# EAGLE design Single Sided Smoothie v2 (EAGLE 6.4)
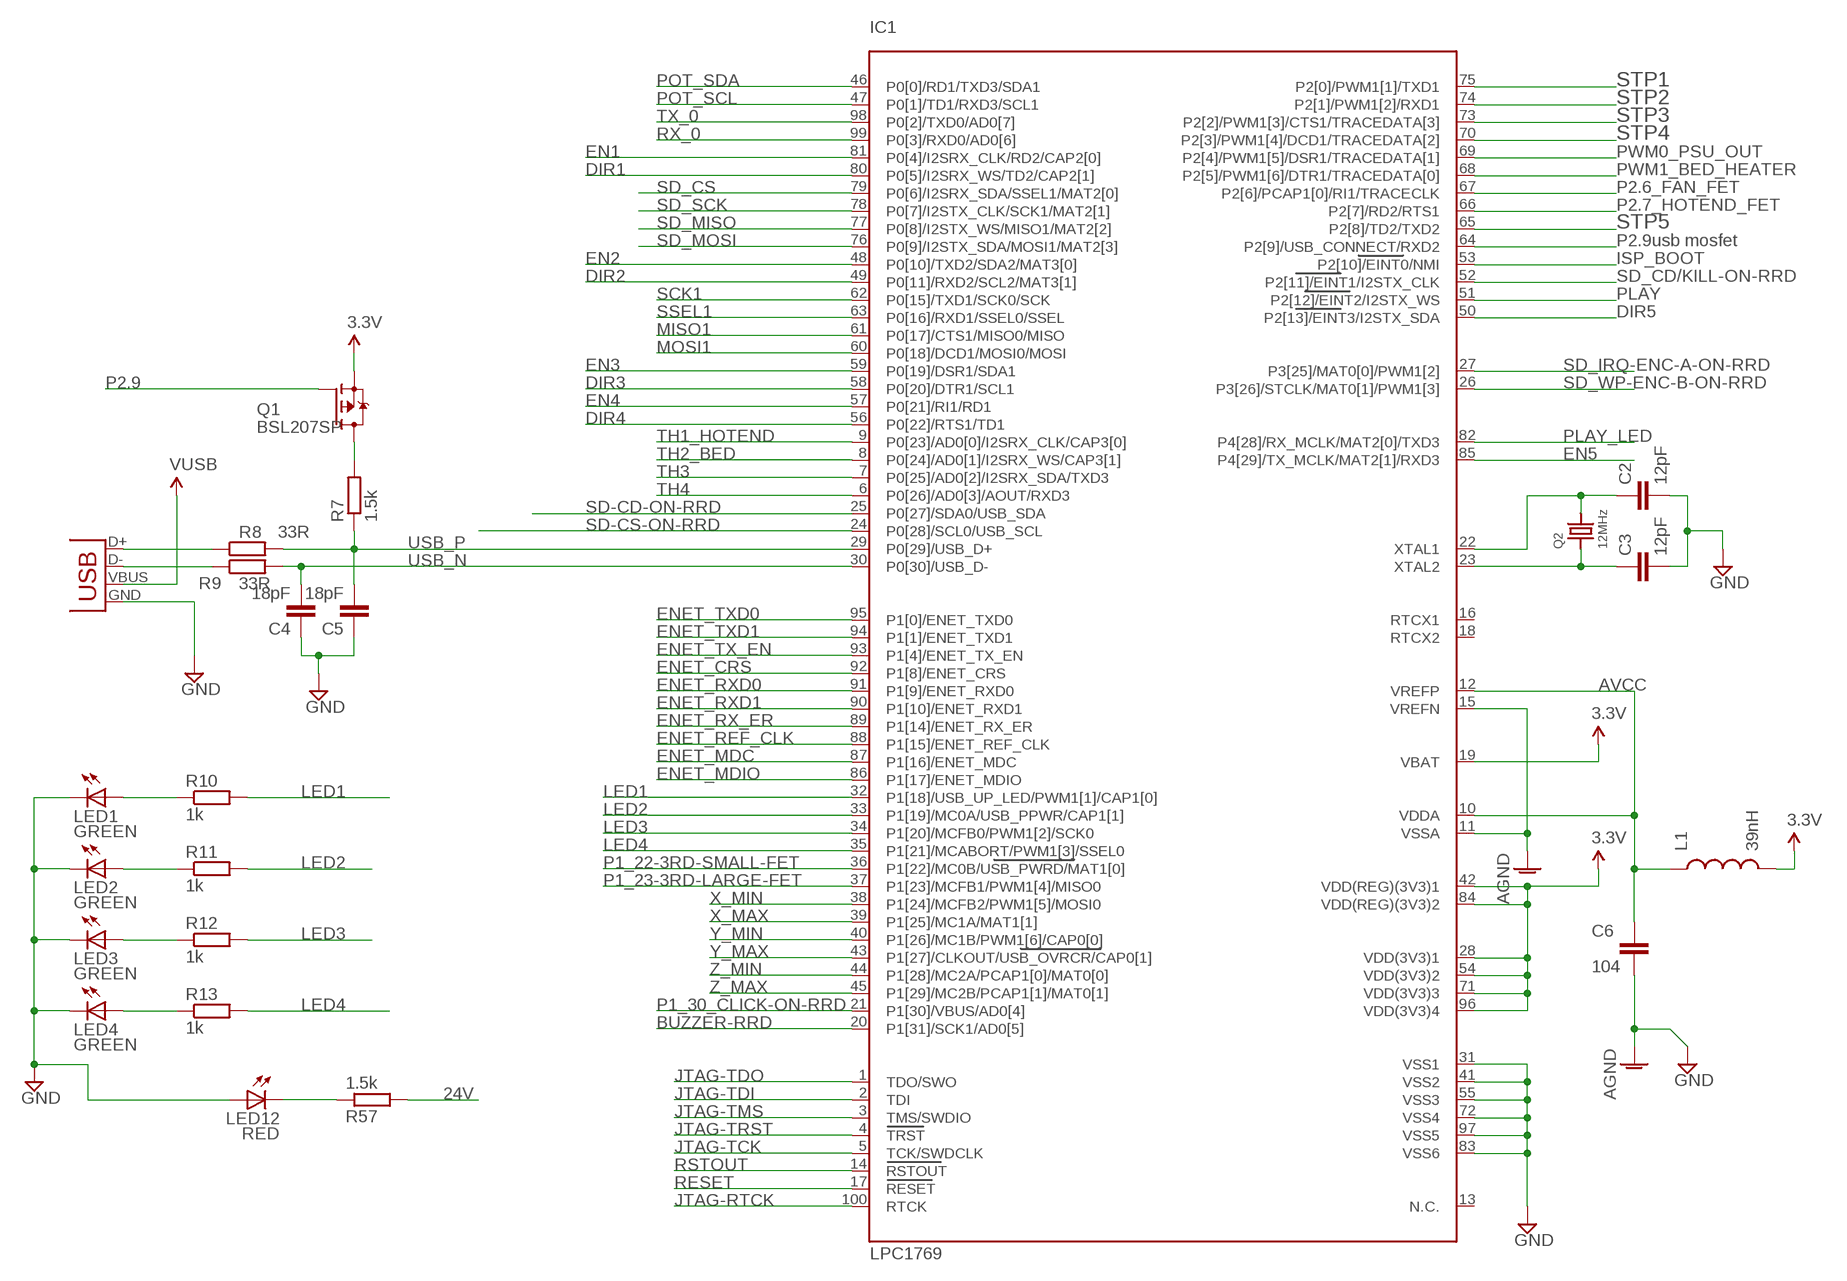
[diagram p0: schematic, sheet 1]

## Parts
C2  12pF  C-EUC0603  [C0603]
C3  12pF  C-EUC0603  [C0603]
C4  18pF  C-EUC0603  [C0603]
C5  18pF  C-EUC0603  [C0603]
C6  104  C-EUC0603  [C0603]
IC1  LPC1769  LPC1768  [LQFP100]
L1  39nH  INDUCTOR0603  [0603]
LED1  GREEN  LEDSML0603  [SML0603]
LED2  GREEN  LEDSML0603  [SML0603]
LED3  GREEN  LEDSML0603  [SML0603]
LED4  GREEN  LEDSML0603  [SML0603]
LED12  RED  LEDSML0603  [SML0603]
Q1  BSL207SP  [SC74_INFINEON]
Q2  12MHz  CRYSTALTHIN  [CRYSTAL_3.2X2.5]
R7  1.5k  R-EU_R0603  [R0603]
R8  33R  R-EU_R0603  [R0603]
R9  33R  R-EU_R0603  [R0603]
R10  1k  R-EU_R0603  [R0603]
R11  1k  R-EU_R0603  [R0603]
R12  1k  R-EU_R0603  [R0603]
R13  1k  R-EU_R0603  [R0603]
R57  1.5k  R-EU_R0603  [R0603]
X14  USBPTH  [USB-B-PTH]

## Nets
3.3V: IC1.19(VBAT) IC1.28(VDD(3V3)1) IC1.42(VDD(REG)(3V3)1) IC1.54(VDD(3V3)2) IC1.71(VDD(3V3)3) IC1.84(VDD(REG)(3V3)2) IC1.96(VDD(3V3)4) L1.2 Q1.4(S)
24V: R57.2
AGND: C6.2 IC1.11(VSSA) IC1.15(VREFN) ; supply symbol labelled GND
AVCC: C6.1 IC1.10(VDDA) IC1.12(VREFP) L1.1
BUZZER-RRD: IC1.20(P1[31]/SCK1/AD0[5])
DIR1: IC1.80(P0[5]/I2SRX_WS/TD2/CAP2[1])
DIR2: IC1.49(P0[11]/RXD2/SCL2/MAT3[1])
DIR3: IC1.58(P0[20]/DTR1/SCL1)
DIR4: IC1.56(P0[22]/RTS1/TD1)
DIR5: IC1.50(P2[13]/EINT3/I2STX_SDA)
EN1: IC1.81(P0[4]/I2SRX_CLK/RD2/CAP2[0])
EN2: IC1.48(P0[10]/TXD2/SDA2/MAT3[0])
EN3: IC1.59(P0[19]/DSR1/SDA1)
EN4: IC1.57(P0[21]/RI1/RD1)
EN5: IC1.85(P4[29]/TX_MCLK/MAT2[1]/RXD3)
ENET_CRS: IC1.92(P1[8]/ENET_CRS)
ENET_MDC: IC1.87(P1[16]/ENET_MDC)
ENET_MDIO: IC1.86(P1[17]/ENET_MDIO)
ENET_REF_CLK: IC1.88(P1[15]/ENET_REF_CLK)
ENET_RX_ER: IC1.89(P1[14]/ENET_RX_ER)
ENET_RXD0: IC1.91(P1[9]/ENET_RXD0)
ENET_RXD1: IC1.90(P1[10]/ENET_RXD1)
ENET_TX_EN: IC1.93(P1[4]/ENET_TX_EN)
ENET_TXD0: IC1.95(P1[0]/ENET_TXD0)
ENET_TXD1: IC1.94(P1[1]/ENET_TXD1)
GND: C2.2 C3.2 C4.1 C5.1 IC1.31(VSS1) IC1.41(VSS2) IC1.55(VSS3) IC1.72(VSS4) IC1.83(VSS6) IC1.97(VSS5) LED1.C LED2.C LED3.C LED4.C LED12.A X14.GND
ISP_BOOT: IC1.53(P2[10]/EINT0/NMI)
JTAG-RTCK: IC1.100(RTCK)
JTAG-TCK: IC1.5(TCK/SWDCLK)
JTAG-TDI: IC1.2(TDI)
JTAG-TDO: IC1.1(TDO/SWO)
JTAG-TMS: IC1.3(TMS/SWDIO)
JTAG-TRST: IC1.4(TRST)
LED1: IC1.32(P1[18]/USB_UP_LED/PWM1[1]/CAP1[0]) R10.2
LED2: IC1.33(P1[19]/MC0A/USB_PPWR/CAP1[1]) R11.2
LED3: IC1.34(P1[20]/MCFB0/PWM1[2]/SCK0) R12.2
LED4: IC1.35(P1[21]/MCABORT/PWM1[3]/SSEL0) R13.2
MISO1: IC1.61(P0[17]/CTS1/MISO0/MISO)
MOSI1: IC1.60(P0[18]/DCD1/MOSI0/MOSI)
N$1: C2.1 IC1.22(XTAL1) Q2.2
N$2: C3.1 IC1.23(XTAL2) Q2.1
N$23: LED12.C R57.1
N$51: Q1.1(D) Q1.2(D) Q1.5(D) Q1.6(D) R7.2
N$61: R8.1 X14.D+
N$62: R9.1 X14.D-
N$84: LED4.A R13.1
N$85: LED3.A R12.1
N$86: LED2.A R11.1
N$87: LED1.A R10.1
P1_22-3RD-SMALL-FET: IC1.36(P1[22]/MC0B/USB_PWRD/MAT1[0])
P1_23-3RD-LARGE-FET: IC1.37(P1[23]/MCFB1/PWM1[4]/MISO0)
P1_30_CLICK-ON-RRD: IC1.21(P1[30]/VBUS/AD0[4])
P2.6_FAN_FET: IC1.67(P2[6]/PCAP1[0]/RI1/TRACECLK)
P2.7_HOTEND_FET: IC1.66(P2[7]/RD2/RTS1)
P2.9: IC1.64(P2[9]/USB_CONNECT/RXD2) Q1.3(G)
PLAY: IC1.51(P2[12]/EINT2/I2STX_WS)
PLAY_LED: IC1.82(P4[28]/RX_MCLK/MAT2[0]/TXD3)
POT_SCL: IC1.47(P0[1]/TD1/RXD3/SCL1)
POT_SDA: IC1.46(P0[0]/RD1/TXD3/SDA1)
PWM0_PSU_OUT: IC1.69(P2[4]/PWM1[5]/DSR1/TRACEDATA[1])
PWM1_BED_HEATER: IC1.68(P2[5]/PWM1[6]/DTR1/TRACEDATA[0])
RESET: IC1.17(RESET)
RSTOUT: IC1.14(RSTOUT)
RX_0: IC1.99(P0[3]/RXD0/AD0[6])
SCK1: IC1.62(P0[15]/TXD1/SCK0/SCK)
SD-CD-ON-RRD: IC1.25(P0[27]/SDA0/USB_SDA)
SD-CS-ON-RRD: IC1.24(P0[28]/SCL0/USB_SCL)
SD_CD/KILL-ON-RRD: IC1.52(P2[11]/EINT1/I2STX_CLK)
SD_CS: IC1.79(P0[6]/I2SRX_SDA/SSEL1/MAT2[0])
SD_IRQ-ENC-A-ON-RRD: IC1.27(P3[25]/MAT0[0]/PWM1[2])
SD_MISO: IC1.77(P0[8]/I2STX_WS/MISO1/MAT2[2])
SD_MOSI: IC1.76(P0[9]/I2STX_SDA/MOSI1/MAT2[3])
SD_SCK: IC1.78(P0[7]/I2STX_CLK/SCK1/MAT2[1])
SD_WP-ENC-B-ON-RRD: IC1.26(P3[26]/STCLK/MAT0[1]/PWM1[3])
SSEL1: IC1.63(P0[16]/RXD1/SSEL0/SSEL)
STP1: IC1.75(P2[0]/PWM1[1]/TXD1)
STP2: IC1.74(P2[1]/PWM1[2]/RXD1)
STP3: IC1.73(P2[2]/PWM1[3]/CTS1/TRACEDATA[3])
STP4: IC1.70(P2[3]/PWM1[4]/DCD1/TRACEDATA[2])
STP5: IC1.65(P2[8]/TD2/TXD2)
TH1_HOTEND: IC1.9(P0[23]/AD0[0]/I2SRX_CLK/CAP3[0])
TH2_BED: IC1.8(P0[24]/AD0[1]/I2SRX_WS/CAP3[1])
TH3: IC1.7(P0[25]/AD0[2]/I2SRX_SDA/TXD3)
TH4: IC1.6(P0[26]/AD0[3]/AOUT/RXD3)
TX_0: IC1.98(P0[2]/TXD0/AD0[7])
USB_N: C4.2 IC1.30(P0[30]/USB_D-) R9.2
USB_P: C5.2 IC1.29(P0[29]/USB_D+) R7.1 R8.2
VUSB: X14.VBUS
X_MAX: IC1.39(P1[25]/MC1A/MAT1[1])
X_MIN: IC1.38(P1[24]/MCFB2/PWM1[5]/MOSI0)
Y_MAX: IC1.43(P1[27]/CLKOUT/USB_OVRCR/CAP0[1])
Y_MIN: IC1.40(P1[26]/MC1B/PWM1[6]/CAP0[0])
Z_MAX: IC1.45(P1[29]/MC2B/PCAP1[1]/MAT0[1])
Z_MIN: IC1.44(P1[28]/MC2A/PCAP1[0]/MAT0[0])
Unconnected: IC1.13(N.C.) IC1.16(RTCX1) IC1.18(RTCX2)

## Notes on the sheet
- usb mosfet

## Library data of the parts
C2-C6 = rcl:C-EU: CAPACITOR, European symbol
IC1 = microbuilder:LPC1768: LPC1768 100 MHz 32-bit ARM Cortex-M3 based microcontroller featuring a high level of integration and low power consumption. 512 kB Flash, 64 kB SRAM, USB Device/Host/OTG, Ethernet, CAN, I2S, 10-bit DAC Digikey: 568-4796-ND
L1 = SparkFun:INDUCTOR: Inductors Basic Inductor/Choke - 0603 and 1206. Footprints are not proven and vary greatly between part numbers.
LED1-LED4 LED12 = led:LED: LED OSRAM: - CHIPLED LG R971, LG N971, LY N971, LG Q971, LY Q971, LO R971, LY R971 LH N974, LH R974 LS Q976, LO Q976, LY Q976 LO Q996 - Hyper CHIPLED LW Q18S LB Q993, LB Q99A, LB R99A - SideLED LS A670, LO A670, LY A670, LG A670, LP A670 LB A673, LV A673, LT A673, LW A673 LH A674 LY A675 LS A676, LA A676, LO A676, LY A676, LW A676 LS A679, LY A679, LG A679 - Hyper Micro SIDELED® LS Y876, LA Y876, LO Y876, LY Y876 LT Y87S - SmartLED LW L88C, LW L88S LB L89C, LB L89S, LG L890 LS L89K, LO L89K, LY L89K LS L896, LA L896, LO L896, LY L896 - TOPLED LS T670, LO T670, LY T670, LG T670, LP T670 LSG T670, LSP T670, LSY T670, LOP T670, LYG T670 LG T671, LOG T671, LSG T671 LB T673, LV T673, LT T673, LW T673 LH T674 LS T676, LA T676, LO T676, LY T676, LB T676, LH T676, LSB T676, LW T676 LB T67C, LV T67C, LT T67C, LS T67K, LO T67K, LY T67K, LW E67C LS E67B, LA E67B, LO E67B, LY E67B, LB E67C, LV E67C, LT E67C LW T67C LS T679, LY T679, LG T679 LS T770, LO T770, LY T770, LG T770, LP T770 LB T773, LV T773, LT T773, LW T773 LH T774 LS E675, LA E675, LY E675, LS T675 LS T776, LA T776, LO T776, LY T776, LB T776 LHGB T686 LT T68C, LB T68C - Hyper Mini TOPLED® LB M676 - Mini TOPLED Santana® LG M470 LS M47K, LO M47K, LY M47K Source: http://www.osram.convergy.de LUXEON: - LUMILED® LXK2-PW12-R00, LXK2-PW12-S00, LXK2-PW14-U00, LXK2-PW14-V00 LXK2-PM12-R00, LXK2-PM12-S00, LXK2-PM14-U00 LXK2-PE12-Q00, LXK2-PE12-R00, LXK2-PE12-S00, LXK2-PE14-T00, LXK2-PE14-U00 LXK2-PB12-K00, LXK2-PB12-L00, LXK2-PB12-M00, LXK2-PB14-N00, LXK2-PB14-P00, LXK2-PB14-Q00 LXK2-PR12-L00, LXK2-PR12-M00, LXK2-PR14-Q00, LXK2-PR14-R00 LXK2-PD12-Q00, LXK2-PD12-R00, LXK2-PD12-S00 LXK2-PH12-R00, LXK2-PH12-S00 LXK2-PL12-P00, LXK2-PL12-Q00, LXK2-PL12-R00 Source: www.luxeon.com KINGBRIGHT: KA-3528ASYC Source: www.kingbright.com
Q1 = transistor-fet:BSL207SP: OptiMOS(R)-P Small-Signal-Transistor P-Channel, Enhancement mode, Super Logic Level (2.5 V rated) Source: http://www.infineon.com/upload/Document/BSL207SP_Rev2.01.pdf
Q2 = microbuilder:CRYSTAL: Crystals HC49UP - Surface Mount Crystal 4.0MHz 18pF +/-30ppm Surface Mount Crystal [Digikey: 535-9857-1-ND] 12.0 MHz Surface Mount Crystal [Digikey: 535-9869-6-ND] 25.0 MHz Surface Mount Crystal [Digikey: 535-9078-1-ND] 2.5 x 2.0mm - MEMs SMT Crystal 16.0 MHz 10pF 20ppm 2.5 x 2.0mm Crystal [Digikey -40-85°C: 535-10923-1-ND] 3.2 x 2.5mm - MEMs SMT Crystal 12.0 MHz 8pF 15ppm 3.2 x 2.5mm Crystal [Digikey: -10-70°C: 644-1047-1-ND -40-125°C: 644-1128-1-ND] 16.0 MHz 8pF 15ppm 3.2 x 2.5mm Crystal [Digikey: -10-70°C: 644-1049-1-ND -40-125°C: 644-1129-2-ND] 16.0 MHz 10pF 10ppm 3.2 x 2.5mm Crystal [Digikey: 644-1100-1-ND] 27.12 MHz 18pF 30ppm 3.2 x 2.5mm Crystal [Digikey: 887-1424-1-ND] 27.12MHz 10pF 10ppm 3.2 x 2.5mm Crystal [Digikey: 887-1329-1-ND] 4.9 x 1.8mm - MEMs SMT Crystal 32.768 KHz 12.5pF 20ppm 4.9 x 1.8mm Crystal [Digikey: SE2415CT-ND] 8.0 x 3.8mm - Surface Mount Crystal 32.768kHz 12.5pF 20ppm -40°C-85°C [Digikey: 535-9166-2-ND] Cylinder 32.768KHz Cylinder Crystal (2x6mm body) [Ex. Digikey: 300-8341-2-ND]
R7-R13 R57 = resistor:R-EU_: RESISTOR, European symbol
X14 = SparkFun:USB: USB Connectors USB-B-PTH is fully proven SKU : PRT-00139 USB-miniB is fully proven SKU : PRT-00587 USB-A-PCB is untested. USB-A-H is throughly reviewed, but untested. Spark Fun Electronics SKU : PRT-00437 USB-B-SMT is throughly reviewed, but untested. Needs silkscreen touching up. USB-A-S has not been used/tested USB-MB-H has not been used/tested

## Board
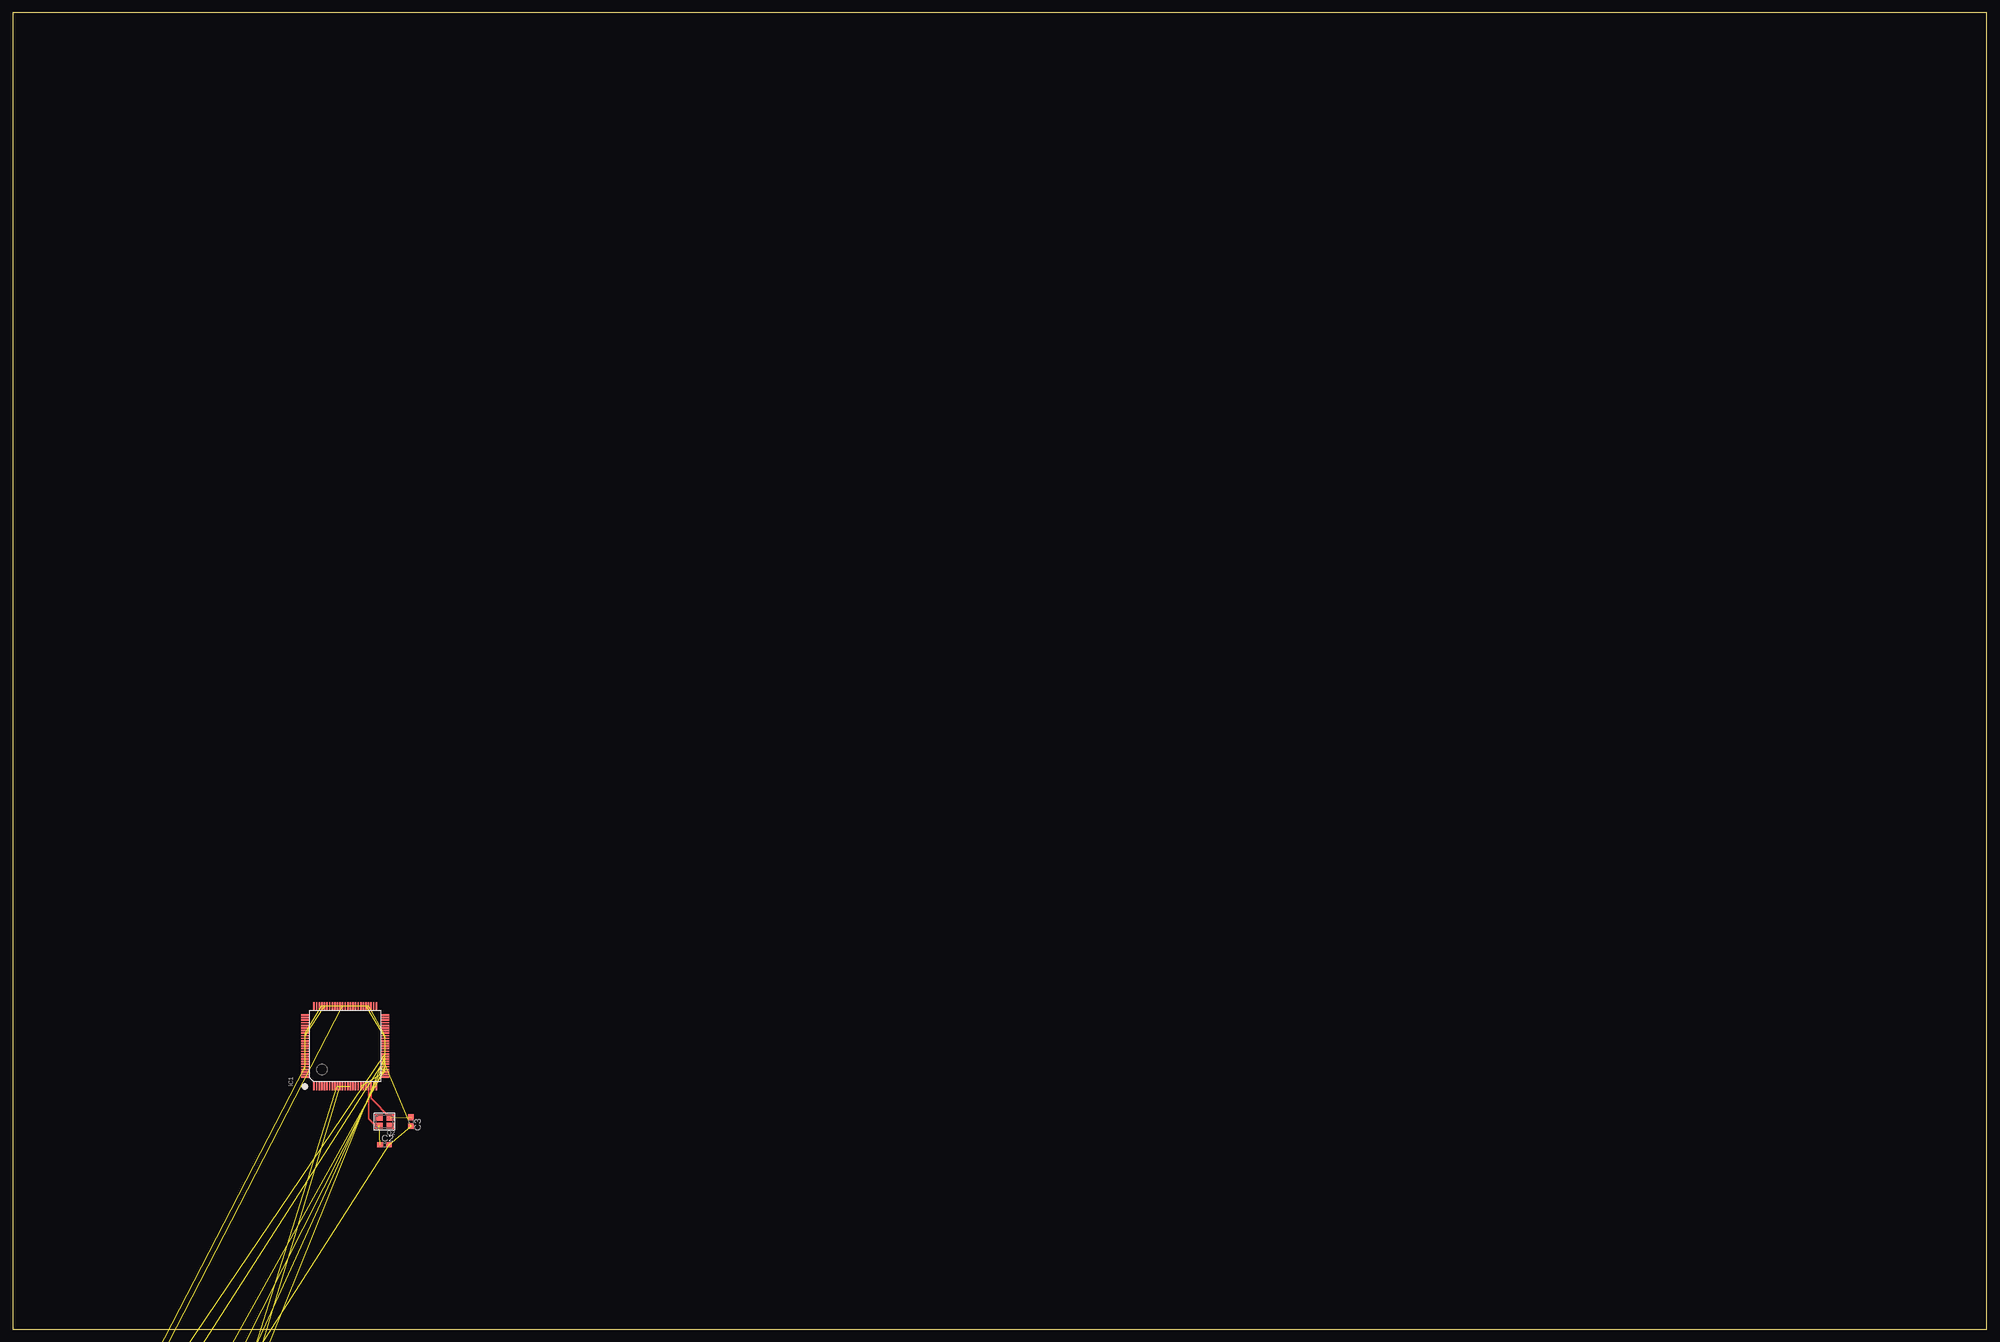
[diagram p1: board, top side]

Size 381 x 254 mm. Coordinates in mm from the lower left corner, seen from the top.
Outline: 0,0 381,0 381,254 0,254 0,0
Copper layers (1*16): Top 0.035mm / dielectric 1.5mm / Bottom 0.035mm
Design rules "Ray CNC *": minimum track width 10mil, minimum drill 24mil, track to track 8mil, track to pad 8mil, pad to pad 8mil, via to via 8mil, smd to smd 8mil, copper to edge 40mil, drill to drill 8mil, minimum pad ring 10mil, minimum via ring 8mil, stop-mask expansion 4mil, vias tented up to drill 0mil, thermal gap 10mil

### Footprints (pad centres in the part's own frame; a part is rotated, then mirrored left to right if it is on the bottom)
C0603 = smd 1.1 x 1: 1 -0.85,0; 2 0.85,0
LQFP100 = smd 0.27 x 1.5: 1 -6,-7.75; 2 -5.5,-7.75; 3 -5,-7.75; 4 -4.5,-7.75; 5 -4,-7.75; 6 -3.5,-7.75; 7 -3,-7.75; 8 -2.5,-7.75; 9 -2,-7.75; 10 -1.5,-7.75; 11 -1,-7.75; 12 -0.5,-7.75; 13 0,-7.75; 14 0.5,-7.75; 15 1,-7.75; 16 1.5,-7.75; 17 2,-7.75; 18 2.5,-7.75; 19 3,-7.75; 20 3.5,-7.75; 21 4,-7.75; 22 4.5,-7.75; 23 5,-7.75; 24 5.5,-7.75; 25 6,-7.75; 51 6,7.75; 52 5.5,7.75; 53 5,7.75; 54 4.5,7.75; 55 4,7.75; 56 3.5,7.75; 57 3,7.75; 58 2.5,7.75; 59 2,7.75; 60 1.5,7.75; 61 1,7.75; 62 0.5,7.75; 63 0,7.75; 64 -0.5,7.75; 65 -1,7.75; 66 -1.5,7.75; 67 -2,7.75; 68 -2.5,7.75; 69 -3,7.75; 70 -3.5,7.75; 71 -4,7.75; 72 -4.5,7.75; 73 -5,7.75; 74 -5.5,7.75; 75 -6,7.75 | smd 1.5 x 0.27: 26 7.75,-6; 27 7.75,-5.5; 28 7.75,-5; 29 7.75,-4.5; 30 7.75,-4; 31 7.75,-3.5; 32 7.75,-3; 33 7.75,-2.5; 34 7.75,-2; 35 7.75,-1.5; 36 7.75,-1; 37 7.75,-0.5; 38 7.75,0; 39 7.75,0.5; 40 7.75,1; 41 7.75,1.5; 42 7.75,2; 43 7.75,2.5; 44 7.75,3; 45 7.75,3.5; 46 7.75,4; 47 7.75,4.5; 48 7.75,5; 49 7.75,5.5; 50 7.75,6; 76 -7.75,6; 77 -7.75,5.5; 78 -7.75,5; 79 -7.75,4.5; 80 -7.75,4; 81 -7.75,3.5; 82 -7.75,3; 83 -7.75,2.5; 84 -7.75,2; 85 -7.75,1.5; 86 -7.75,1; 87 -7.75,0.5; 88 -7.75,0; 89 -7.75,-0.5; 90 -7.75,-1; 91 -7.75,-1.5; 92 -7.75,-2; 93 -7.75,-2.5; 94 -7.75,-3; 95 -7.75,-3.5; 96 -7.75,-4; 97 -7.75,-4.5; 98 -7.75,-5; 99 -7.75,-5.5; 100 -7.75,-6
0603 = smd 1.1 x 1: 1 -0.85,0; 2 0.85,0
SML0603 = smd 0.8 x 0.8: A 0.75,0; C -0.75,0
SC74_INFINEON = smd 0.5 x 0.5: 1 -0.95,-1.2; 2 0,-1.2; 3 0.95,-1.2; 4 0.95,1.2; 5 0,1.2; 6 -0.95,1.2
CRYSTAL_3.2X2.5 = smd 1.4 x 1.2: 1 -1.1,-0.8; 2 1.1,0.8; GND1 -1.1,0.8; GND2 1.1,-0.8
R0603 = smd 1 x 1.1: 1 -0.85,0; 2 0.85,0
USB-B-PTH = drill 0.914 pad 1.676: D+ 0,1.25; D- 1.981,1.25; GND 0,-1.25; VBUS 1.981,-1.25 | drill 2.286: S1 -2.718,-6.02; S2 -2.718,6.02

### Placement (x,y rotation side)
C2  71.75,35.56 0 top
C3  76.83,40.01 270 top
C4  22.23,-48.26 0 top  (outside the outline)
C5  27.94,-48.26 0 top  (outside the outline)
C6  33.66,-48.26 0 top  (outside the outline)
IC1  64.14,54.61 0 top
L1  1.91,-53.34 0 top  (outside the outline)
LED1  1.91,-37.47 0 top  (outside the outline)
LED2  10.16,-37.47 0 top  (outside the outline)
LED3  18.41,-37.47 0 top  (outside the outline)
LED4  26.67,-37.47 0 top  (outside the outline)
LED12  1.91,-43.18 0 top  (outside the outline)
Q1  18.41,-22.23 0 top  (outside the outline)
Q2  71.75,40.01 180 top
R7  8.89,-43.18 0 top  (outside the outline)
R8  19.05,-43.18 0 top  (outside the outline)
R9  23.5,-43.18 0 top  (outside the outline)
R10  27.94,-43.18 0 top  (outside the outline)
R11  6.35,-48.9 0 top  (outside the outline)
R12  32.38,-43.18 0 top  (outside the outline)
R13  1.91,-48.9 0 top  (outside the outline)
R57  13.97,-43.18 0 top  (outside the outline)
X14  12.7,-26.67 0 top  (outside the outline)

### Tracks (layer width: path | path; a pad name or v marks a point on that pad's centre or on a via)
3.3V  (8 unrouted)
AGND  (2 unrouted)
AVCC  (3 unrouted)
GND  (15 unrouted)
LED1  (1 unrouted)
LED2  (1 unrouted)
LED3  (1 unrouted)
LED4  (1 unrouted)
N$1  (1 unrouted)
  Top 0.254: IC1.22 68.64,40.59 70.02,39.2 Q2.2
N$2  (1 unrouted)
  Top 0.254: IC1.23 69.14,44.52 Q2.1
N$23  (1 unrouted)
N$51  (4 unrouted)
N$61  (1 unrouted)
N$62  (1 unrouted)
N$84  (1 unrouted)
N$85  (1 unrouted)
N$86  (1 unrouted)
N$87  (1 unrouted)
P2.9  (1 unrouted)
USB_N  (2 unrouted)
USB_P  (3 unrouted)